# EAGLE design esp07_1w (EAGLE 7.4.0)
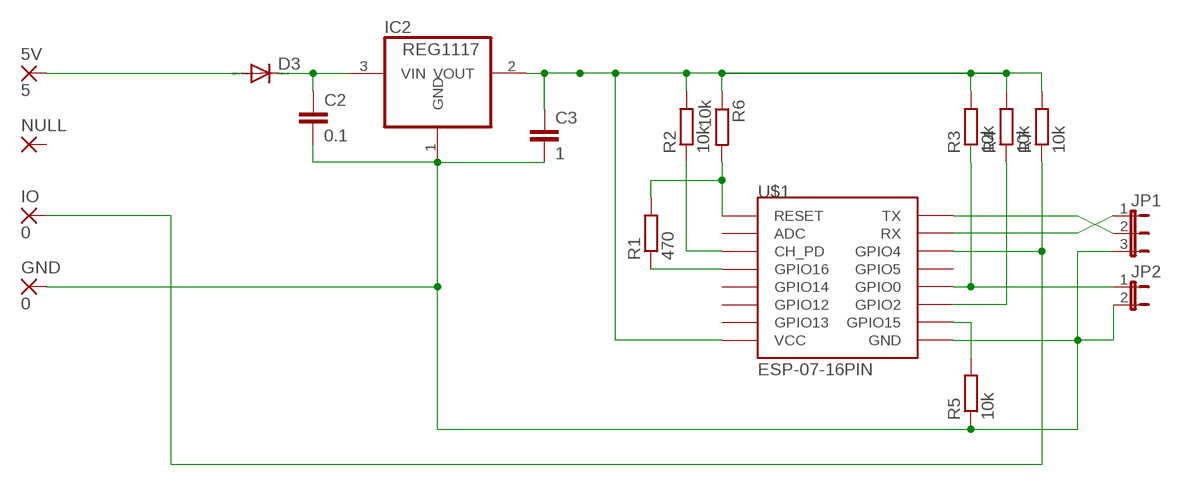
[diagram p0: schematic, sheet 1]

## Parts
5V  5  3,81/1,4  [3,81/1,4]
C2  0.1  C-EUC0805  [C0805]
C3  1  C-EUC0805  [C0805]
D3  DIODE-SOD80C  [SOD80C]
GND  0  3,81/1,4  [3,81/1,4]
IC2  REG1117  [SOT223]
IO  0  3,81/1,4  [3,81/1,4]
JP1  JP2E  [JP2]
JP2  JP1E  [JP1]
NULL  3,81/1,4  [3,81/1,4]
R1  470  R-EU_R1206  [R1206]
R2  10k  R-EU_R1206  [R1206]
R3  10k  R-EU_R1206  [R1206]
R4  10k  R-EU_R1206  [R1206]
R5  10k  R-EU_R1206  [R1206]
R6  10k  R-EU_R1206  [R1206]
R7  10k  R-EU_R1206  [R1206]
U$1  ESP-07-16PIN  [ESP-07-16PIN]

## Nets
N$1: 5V.1(P) D3.A
N$2: IO.1(P) R7.1 U$1.GPIO4
N$3: C3.1 IC2.2(VOUT) R2.2 R3.2 R4.2 R6.1 R7.2 U$1.VCC
N$4: C2.2 C3.2 GND.1(P) IC2.1(GND) JP1.3 JP2.2 R5.1 U$1.GND
N$5: JP1.2 U$1.TX
N$6: JP1.1 U$1.RX
N$7: R1.1 U$1.GPIO16
N$8: R5.2 U$1.GPIO15
N$9: JP2.1 R3.1 U$1.GPIO0
N$10: R4.1 U$1.GPIO2
N$11: R2.1 U$1.CH_PD
N$12: R1.2 R6.2 U$1.REST(RESET)
N$20: C2.1 D3.C IC2.3(VIN)
Unconnected: NULL.1(P) U$1.ADC U$1.GPIO5 U$1.GPIO12 U$1.GPIO13 U$1.GPIO14

## Library data of the parts
5V GND IO NULL = wirepad:3,81/1,4: THROUGH-HOLE PAD
C2 C3 = rcl:C-EU: CAPACITOR, European symbol
D3 = diode:DIODE-: DIODE
IC2 = burr-brown:REG1117: 800mA and 1A Low Dropout (LDO) Positive Regulator 1.8V, 2.5V, 2.85V, 3.3V, 5V, and Adj; MPN: REG1117; OC_FARNELL: 1097566; OC_NEWARK: 14P6981
JP1 = jumper:JP2E: JUMPER
JP2 = jumper:JP1E: JUMPER
R1-R7 = resistor:R-EU_: RESISTOR, European symbol
U$1 = esp8266modules:ESP-07-16PIN: ESP8266 Wifi Module ESP-07 - 16 pins; DIMENSIONS: 22.0 x 16.0 mm; PINS: 16; PITCH: 0.078" / 2 mm

## Board
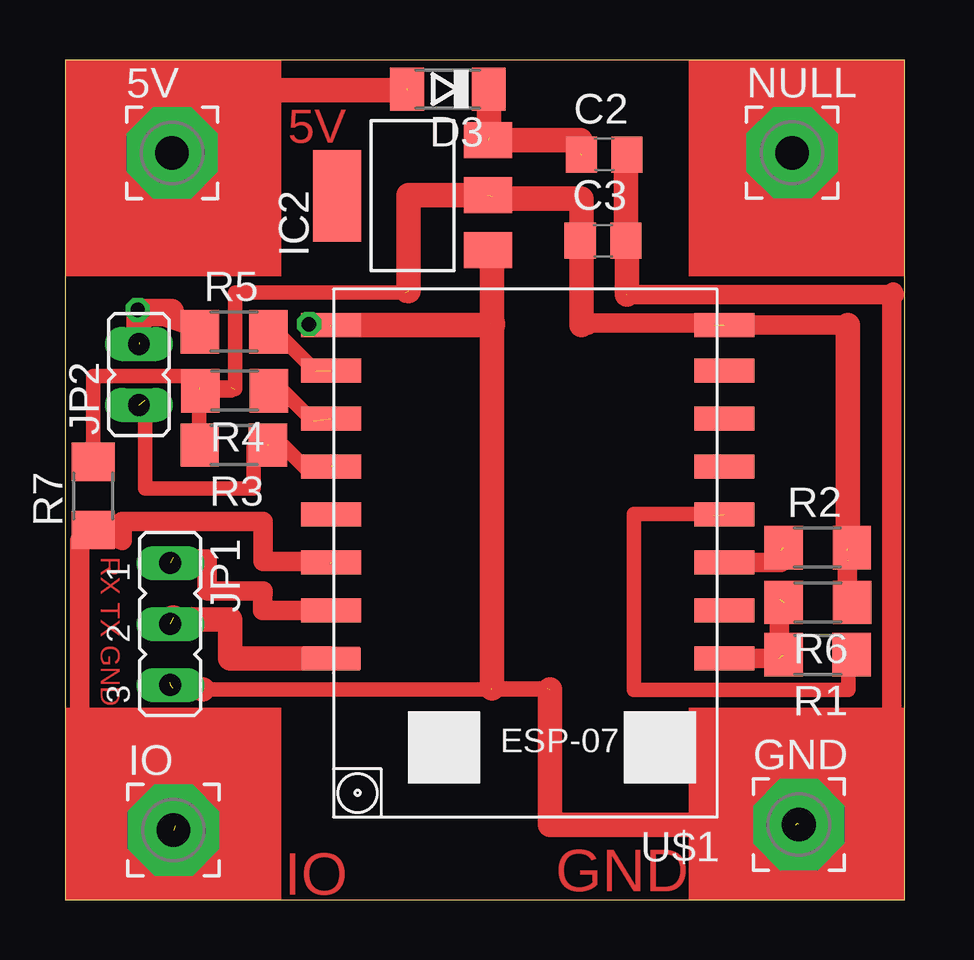
[diagram p1: board, top side]
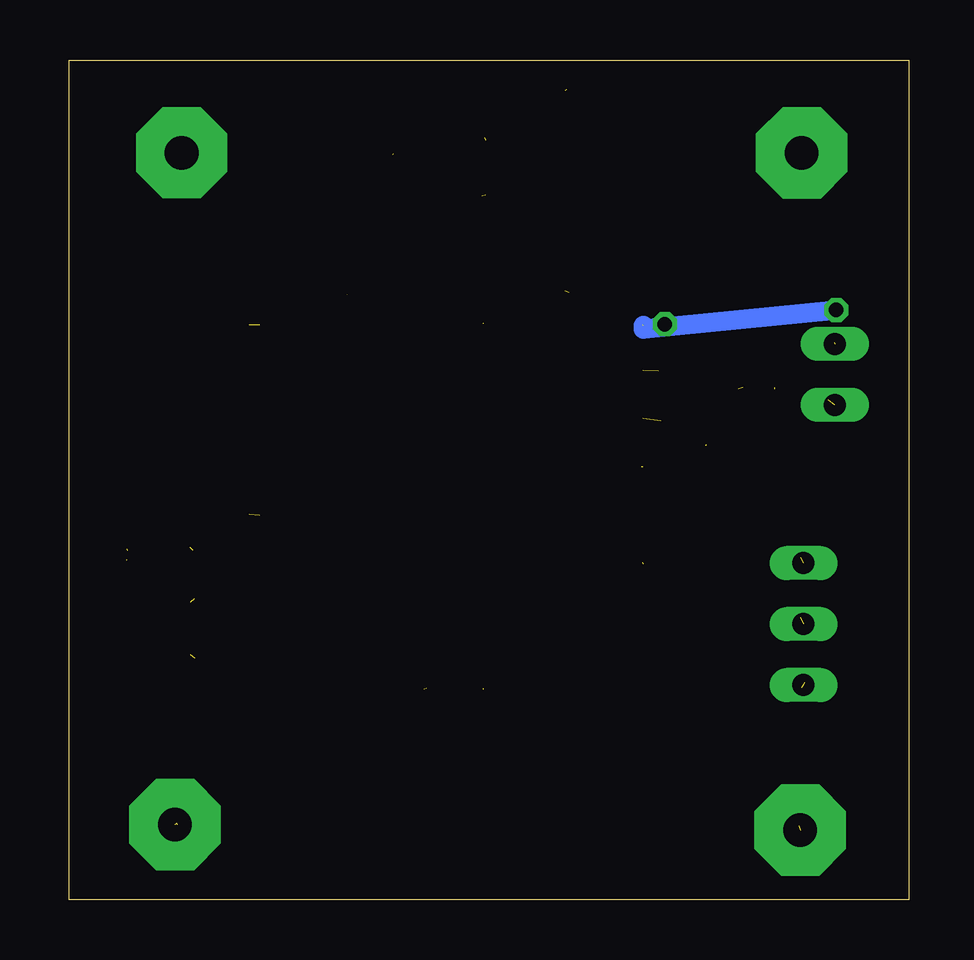
[diagram p2: board, bottom side, seen from below]

Size 35 x 35 mm. Coordinates in mm from the lower left corner, seen from the top.
Outline: 0,0 35,0 35,35 0,35 0,0
Copper layers (1*16): Top 0.035mm / dielectric 1.5mm / Bottom 0.035mm
Design rules "default": minimum track width 10mil, minimum drill 24mil, track to track 8mil, track to pad 8mil, pad to pad 8mil, via to via 8mil, smd to smd 8mil, copper to edge 40mil, drill to drill 8mil, minimum pad ring 10mil, minimum via ring 8mil, stop-mask expansion 4mil, vias tented up to drill 0mil, thermal gap 10mil

### Footprints (pad centres in the part's own frame; a part is rotated, then mirrored left to right if it is on the bottom)
3,81/1,4 = drill 1.397 pad 3.81 octagon: 1 0,0
C0805 = smd 1.3 x 1.5: 1 -0.95,0; 2 0.95,0
SOD80C = smd 1.4 x 1.8: A 1.7,0; C -1.7,0
SOT223 = smd 1.499 x 2.007: 1 -2.261,-3.15; 2 0.025,-3.15; 3 2.311,-3.15 | smd 3.81 x 2.007: 4 0,3.15
JP2 = drill 0.914 long: 1 -2.54,0; 2 0,0; 3 2.54,0
JP1 = drill 0.914 long: 1 0,-1.27; 2 0,1.27
R1206 = smd 1.6 x 1.803: 1 -1.422,0; 2 1.422,0
ESP-07-16PIN = smd 2.5 x 1: ADC -8.2,3.8; CH_PD -8.2,1.8; GND 8.2,-8.105; GPIO0 8.2,-2.2; GPIO2 8.2,-4.2; GPIO4 8.2,1.8; GPIO5 8.2,-0.2; GPIO12 -8.2,-4.2; GPIO13 -8.2,-6.2; GPIO14 -8.2,-2.2; GPIO15 8.2,-6.2; GPIO16 -8.2,-0.2; REST -8.2,5.8; RX 8.2,3.8; TX 8.2,5.8; VCC -8.2,-8.105

### Placement (x,y rotation side)
5V  4.46,31.13 0 top
C2  22.47,31.06 0 top
C3  22.42,27.46 0 top
D3  15.95,33.79 180 top
GND  30.58,3.13 0 top
IC2  14.48,29.34 90 top
IO  4.52,2.89 0 top
JP1  4.38,11.49 270 top
JP2  3.07,21.89 0 top
NULL  30.3,31.13 0 top
R1  31.36,10.21 180 top
R2  31.37,14.67 0 top
R3  7.03,18.95 180 top
R4  7.06,21.21 180 top
R5  7.04,23.67 0 top
R6  31.37,12.38 180 top
R7  1.16,16.83 90 top
U$1  19.28,15.84 180 top

### Tracks (layer width: path | path; a pad name or v marks a point on that pad's centre or on a via)
N$1  (1 unrouted)
  Top 1.016: 5V.1 8.29,31.13 8.29,33.73 14.29,33.73
N$2  (2 unrouted)
  Top 0.813: 4.58,3.08 4.58,2.92 4.53,2.92 4.53,2.97 0.59,2.97 0.59,14.98 R7.1 2.37,14.98 2.37,15.77 8.25,15.77 8.25,14.09 11.05,14.09 11.05,13.99
N$3  (7 unrouted)
  Top 0.61: 7.09,21.28 7.09,25.31 14.16,25.31 14.16,25.18 | R7.2 1.17,17.82 1.17,21.82 5.59,21.82 | R4.2 6.92,21.21 6.92,21.34 5.64,21.34 5.64,21.29 5.59,21.29 5.59,18.95 R3.2 | 5.7,21.82 5.59,21.82 | 5.59,21.82 5.59,21.34
  Top 0.813: 32.62,23.95 27.06,23.95 27.06,24.04 21.79,24.04 | 21.79,24.04 21.57,24.04 21.57,23.95 | 21.52,23.95 21.79,23.95 21.79,24.04 | R6.1 32.6,12.18 32.6,14.16 | 32.62,14.14 32.57,14.14 32.57,14.55 | R2.2 32.6,14.79 32.6,14.61
  Top 1.016: 21.52,23.95 21.52,27.46 | 21.52,27.46 21.52,29.22 17.79,29.22 17.79,29.33 | 32.62,23.95 32.62,14.14 | C3.1 21.52,27.46 | IC2.2 14.32,29.36 14.32,25.36
N$4  (via drill 0.6)  (10 unrouted)
  Top 0.406: C3.2 23.35,27.46 23.35,30.94
  Top 0.61: R5.1 v3.02,24.57 5.05,23.86 | 17.79,8.81 20.09,8.81 20.09,8.79 | 20.21,8.76 4.47,8.76 4.47,8.83
  Top 0.813: 17.8,15.06 17.8,15.12 | 17.84,24 17.72,24 | 23.42,25.21 34.51,25.21 34.51,25.31 | 23.35,31.05 23.35,30.94 | C2.2 23.4,31.06 23.4,25.22 34.46,25.22 | 34.56,25.22 34.46,25.22 | 34.46,25.22 34.46,3.19 30.52,3.19 30.52,2.97 | U$1.GND 11,23.95 11,23.98 | v3.02,24.57 3.07,23.73 3.07,23.76 3.13,23.76 3.13,23.22 | 17.79,8.81 17.74,8.81 17.74,8.8
  Top 1.016: 4.35,9.05 5.74,8.76 | 20.21,8.76 20.21,3.11 30.47,3.11 | 23.36,31.12 C3.2 23.42,27.46 23.42,25.21 | 17.79,26.96 17.79,27.07 IC2.1 | 17.79,26.96 17.79,24 | 17.79,24 17.79,8.81 | U$1.GND 17.73,23.95 17.84,23.95 17.84,24 | 17.79,26.96 17.84,26.96 17.84,26.99 17.73,26.99 17.73,27.04 | 17.79,24 17.73,24 17.73,24.04 | 3.13,23.22 3.06,23.22 3.06,24.54 4.43,24.54 4.43,24.41 3.09,24.41 3.09,23.23
  Bottom 0.813: v3.02,24.57 11.05,23.79 11.05,23.92
N$5  (1 unrouted)
  Top 1.016: U$1.TX 6.87,10.04 6.87,11.67 4.51,11.67 4.51,11.77
N$6  (1 unrouted)
  Top 0.813: U$1.RX 8.22,12.04 8.22,12.74 8.25,12.74 8.25,12.86 5.94,12.86 5.94,12.89 5.91,12.89 5.91,14.21 4.51,14.21 4.51,14.27
N$7  (1 unrouted)
  Top 0.61: R1.1 32.64,10.02 32.64,8.74 23.71,8.74 23.71,16.07 27.05,16.07 27.05,16.02
N$8  (1 unrouted)
  Top 0.61: R5.2 8.79,23.67 10.43,22.03
N$9  (4 unrouted)
  Top 0.61: 2.47,20.87 2.47,20.83 3.34,20.83 3.34,17.13 7.84,17.13 7.84,18.86 7.94,18.96 8.43,18.96 8.45,18.97 | 11.13,18.05 11.09,18.05 10.96,17.92 10.08,17.92 9.05,18.95 R3.1 8.47,18.95 8.52,18.9 8.52,18.91 8.48,18.96
N$10  (1 unrouted)
  Top 0.61: R4.1 9.07,21.21 10.32,19.95
N$11  (1 unrouted)
  Top 0.813: U$1.CH_PD 29.83,14.04 29.83,14.55
N$12  (2 unrouted)
  Top 0.813: 29.74,10.04 U$1.REST 29.7,10.04 29.7,10.11 29.78,10.11 29.78,12.53
N$13  (via drill 0.6)
  other vias: 10.16,23.98
N$20  (2 unrouted)
  Top 1.016: D3.C 17.67,33.79 17.67,31.75 | IC2.3 21.49,31.65 21.49,31.09
(copper drawn outside any net)
  shapes: Top area x4

### Text on the board
Top: 5V | RX TX GND | IO | GND